# EasyEDA Pro project Scheme.eprj

# Schematic Schematic1

## Sheets
1 board: Board Name: Board1; Create Date: 2026-04-28; Page Name: board; Project Name: Scheme; Schematic Name: Schematic1; Update Date: 2026-04-28; Company: EasyEDA.com; Page Size: A4; Version: V1.0
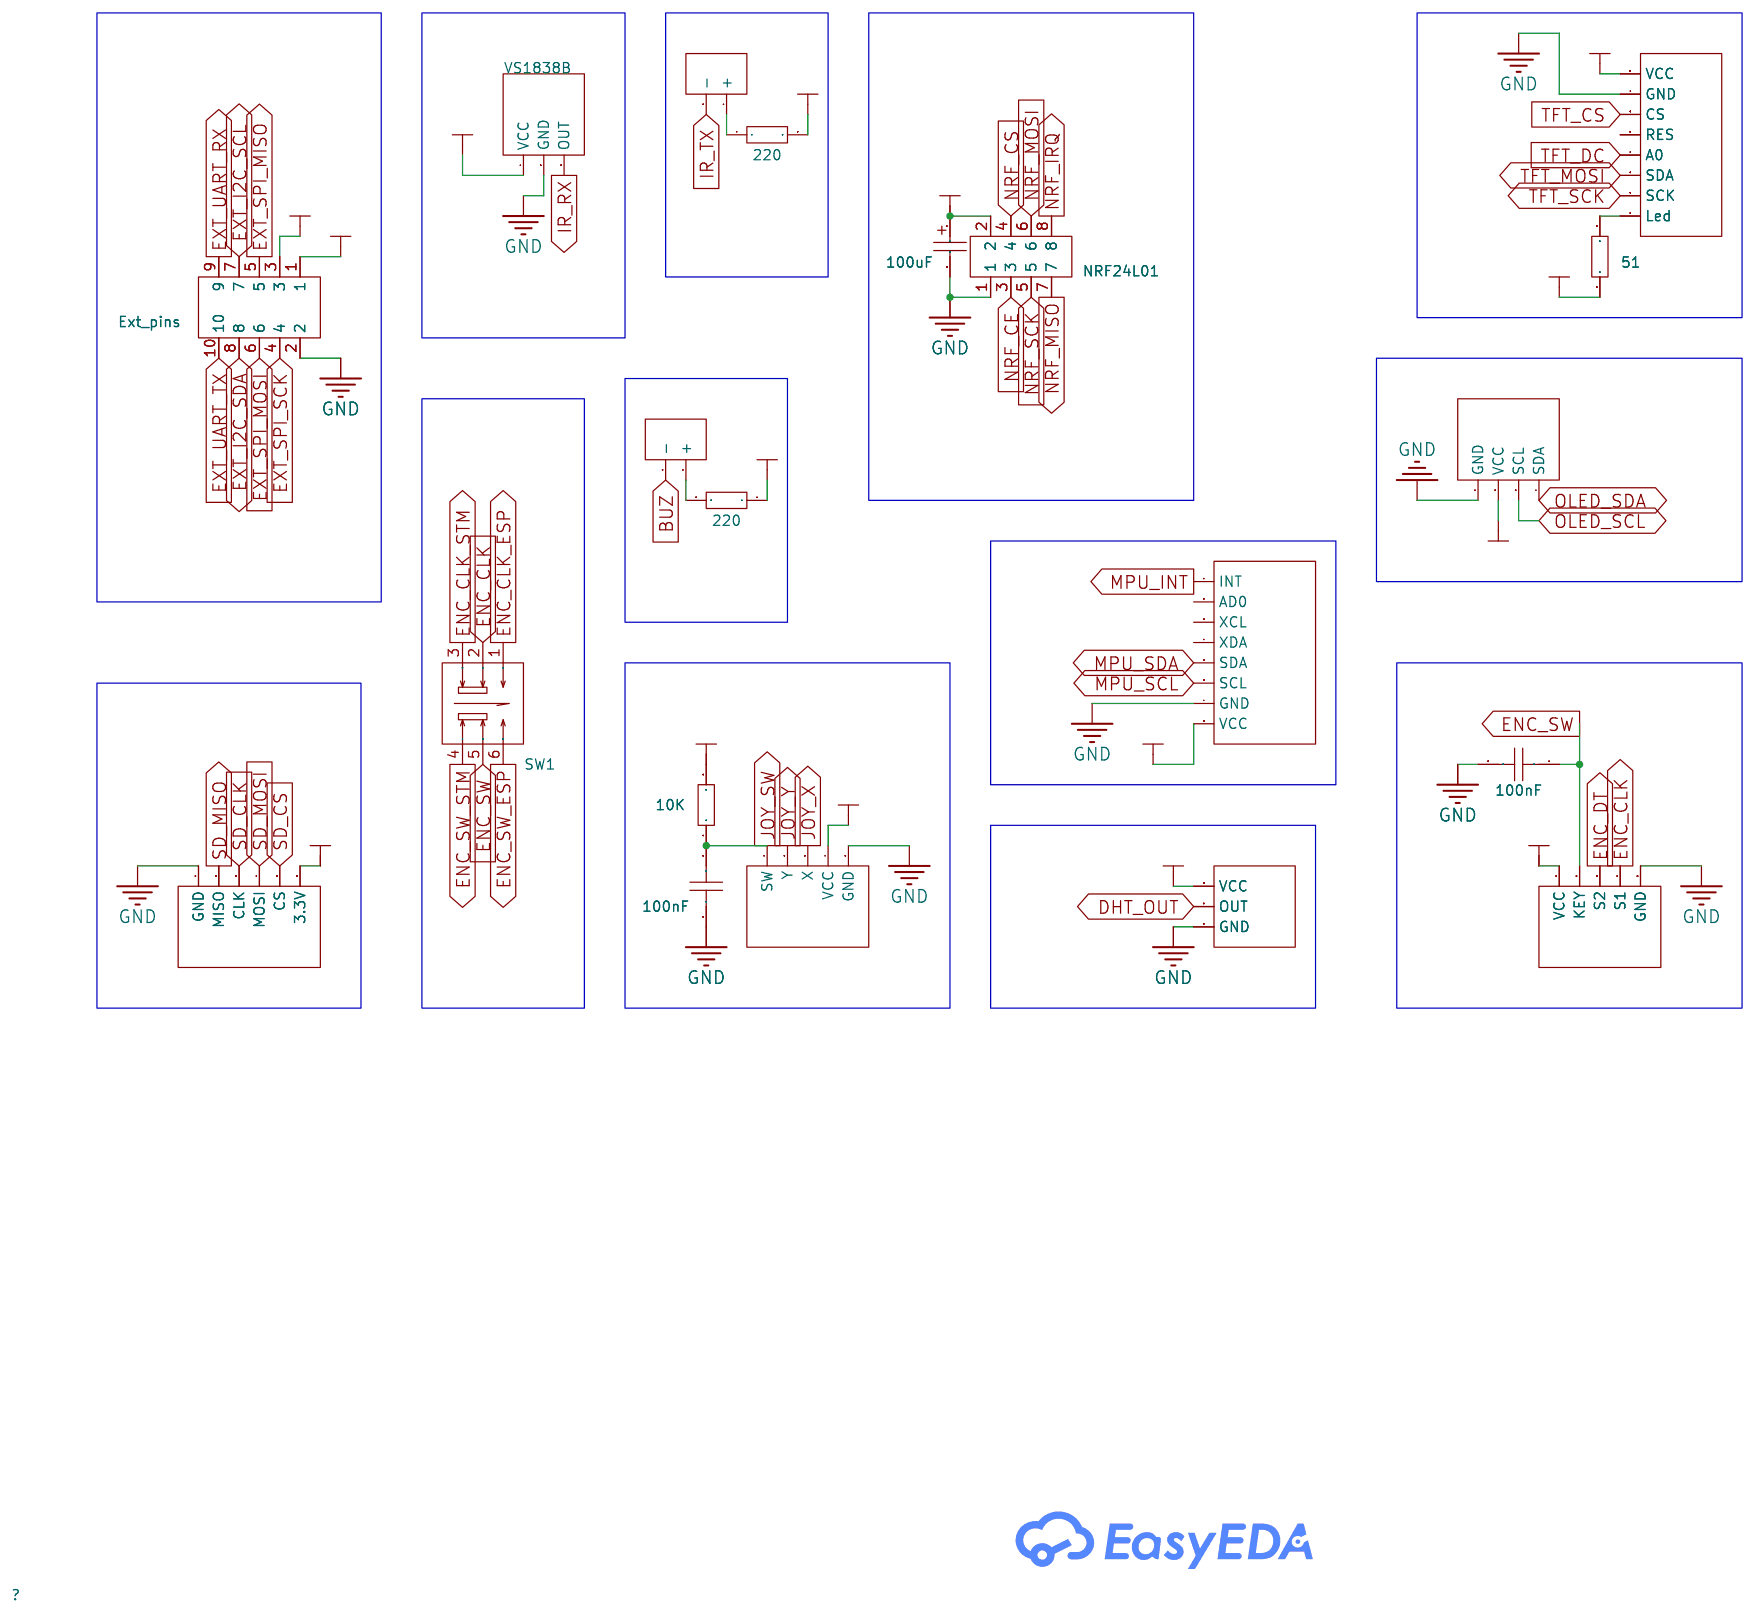
[diagram p0: board]
2 stm: Page Name: stm; Project Name: F411-board
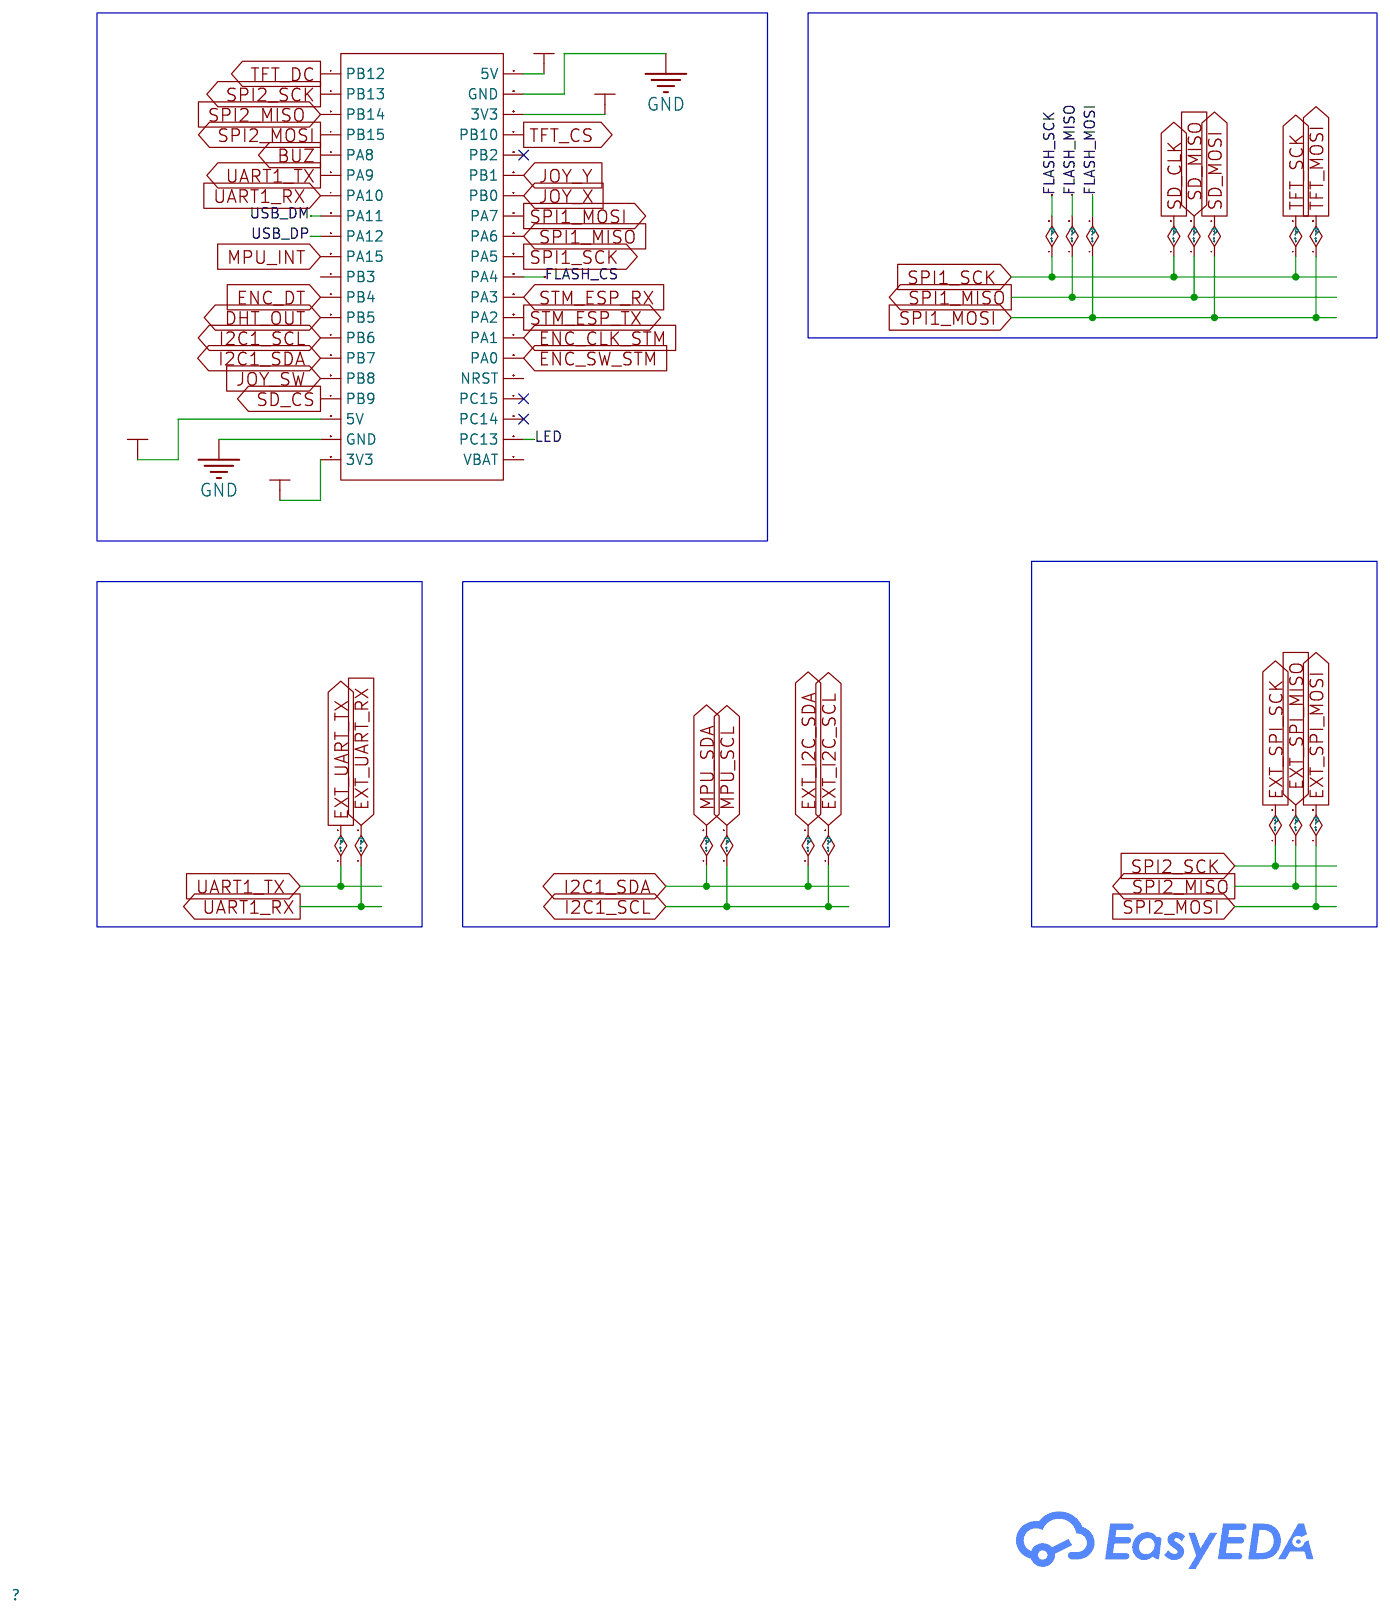
[diagram p1: stm]
3 esp: Page Name: esp; Project Name: F411-board
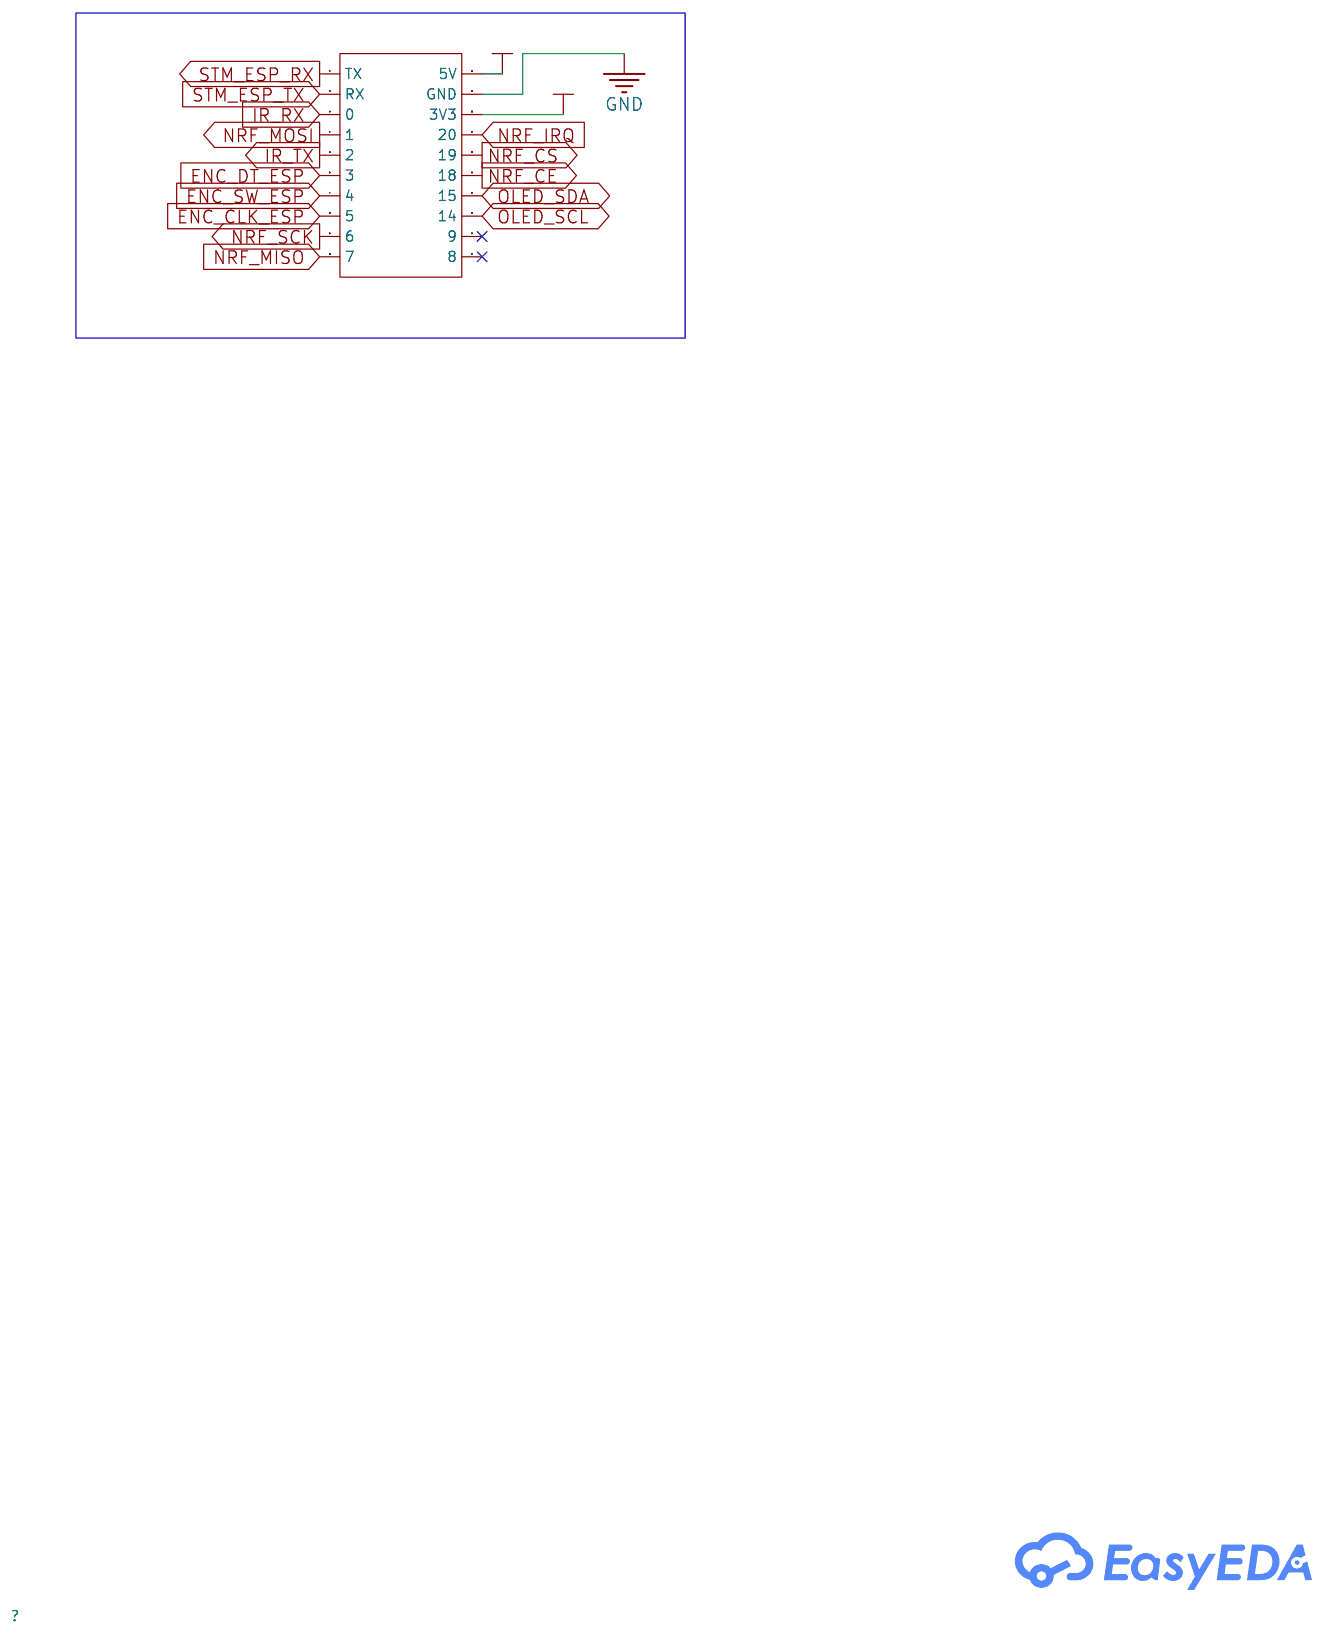
[diagram p2: esp]

## Parts
sheet board
C1  100uF  [CAP-SMD_BD3.0-L3.3-W3.3-RD]
C2  100nF  [C0805]
C3  100nF  [C0805]
H1  Ext_pins  [HDR-TH_10P-P2.54-H-M-R2-C5-S2.54-W12.9]
R1  51  [R0805]
R2  220  [R0805]
R3  220  [R0805]
R4  10K  [R0805]
SW1  XY-TBC8585-Z-F  [SW-TH_6P-L8.5-W8.5-P2.50-LS5.4-BL-2]
U5  NRF24L01  [HDR-TH_8P-P2.54-V-F-R2-C4-S2.54]
U6  -
U7  -
U8  -
U9  -
U10  -
U11  -
U12  -
U13  -
U14  VS1838B
U15  -
sheet esp
U19  -
sheet stm
U18  -

## Library data of the parts
C1 = C_Ele_SMD_3x5.4mm: Supplier Footprint: SMD,3x5.4mm
C2 C3 = CAP_0805: Supplier Footprint: 0805
H1 = PH2.54-07-05PWS: LCSC Part Name: 2x5P 间距:2.54mm 方针 弯插; Supplier Part: C7501619; Manufacturer: XUNPU(讯普); Supplier Footprint: 弯插,P=2.54mm; JLCPCB Part Class: Extended Part; Datasheet: https://item.szlcsc.com/datasheet/PH2.54-07-05PWS/8584173.html; Supplier: LCSC; Pin Structure: 2x5P; Pitch: 2.54mm; Row Spacing: 2.54mm; Circluar Pins/Square Pins: Pin Header; Mounting Type: Right Angle; Number of Rows: 2; Number of Pins: 10P; Current Rating: 3A; Length of Mating Pin: 6mm; Insulation Height: 2.5mm; Length of End Connection Pin: 3mm; Contact Material: Brass; Contact Plating: Gold; Operating Temperature: -40℃~+105℃; Color: Black
R1-R4 = Res_0805: Supplier Footprint: 0805
SW1 = XY-TBC8585-Z-F: LCSC Part Name: 按键开关 8.5*8.5自锁插件 260gf; Supplier Part: C53055056; Manufacturer: XYECONN(辛译); Supplier Footprint: DIP-6P,8.5x8.5mm; JLCPCB Part Class: Extended Part; Datasheet: https://item.szlcsc.com/datasheet/XY-TBC8585-Z-F/55998989.html; Supplier: LCSC; Circuit: DPDT; Self Lock / No Lock: Latching; Actuator Style: Rectangular Plunger; Mounting Type: Through Hole; Contact Current: 100mA; Voltage Rating: 30V; Actuator/Cap Color: White; With Lamp: Without; Termination Style: PC Pin; Operating Force: 2.6N; Life: 10,000 cycles
U5 = PM2.54-2*4-H5.7: LCSC Part Name: 2x4P 间距:2.54mm 直插; Supplier Part: C49261199; Manufacturer: ZHOURI(洲日); Supplier Footprint: 插件,P=2.54mm; JLCPCB Part Class: Extended Part; Datasheet: https://item.szlcsc.com/datasheet/PM2.54-2*4-H5.7/51704067.html; Supplier: LCSC; Holes Structure: 2x4P; Pitch: 2.54mm; Row Spacing: 2.54mm; Circular Hole / Square Hole: Square Hole; Mounting Type: Through Hole; Number of Rows: 2; Number of Positions: 8P; Current Rating: 2.5A; Holes Direction: Top; Insulation Height: 5.7mm; Contact Material: Brass; Operating Temperature: -40℃~+105℃
U6 = TFT-1.8
U7 = OLED-0.96
U8 = MicroSD
U9 = Joystick
U10 = MPU-6050
U11 = Encoder
U12 = DHT-22
U13 = Buzzer
U14 = IR-Receiver
U15 = IR-Led
U19 = ESP32-C6-SuperMini
U18 = STM32F411CEU6

## Nets
3V3: C1.1 H1.1 R3.2 R4.2 U5.2 U7.2(VCC) U8.6(3.3V) U9.4(VCC) U11.1(VCC) U12.3(VCC) U14.1(VCC) U18.20(3V3) U18.38(3V3) U19.18(3V3)
5V: H1.3 R1.1 R2.1 U6.8(VCC) U10.8(VCC) U18.18(5V) U18.40(5V) U19.20(5V)
GND: C1.2 C2.2 C3.2 H1.2 U5.1 U6.7(GND) U7.1(GND) U8.1(GND) U9.5(GND) U10.7(GND) U11.5(GND) U12.1(GND) U14.2(GND) U18.19(GND) U18.39(GND) U19.19(GND)
BUZ: U13.2(-) U18.5(PA8)
DHT_OUT: U12.2(OUT) U18.13(PB5)
ENC_CLK: SW1.2 U11.4(S1)
ENC_CLK_ESP: SW1.1 U19.8(5)
ENC_CLK_STM: SW1.3 U18.27(PA1)
ENC_DT: U11.3(S2) U18.12(PB4)
ENC_DT_ESP: U19.6(3)
ENC_SW: C2.1 SW1.5 U11.2(KEY)
ENC_SW_ESP: SW1.6 U19.7(4)
ENC_SW_STM: SW1.4 U18.26(PA0)
EXT_I2C_SCL: H1.7 U10.6(SCL) U18.14(PB6)
EXT_I2C_SDA: H1.8 U10.5(SDA) U18.15(PB7)
EXT_SPI_MISO: H1.5 U18.3(PB14)
EXT_SPI_MOSI: H1.6 U18.4(PB15)
EXT_SPI_SCK: H1.4 U18.2(PB13)
EXT_UART_RX: H1.9 U18.7(PA10)
EXT_UART_TX: H1.10 U18.6(PA9)
FLASH_CS: U18.30(PA4)
FLASH_MISO: U8.2(MISO) U18.32(PA6)
FLASH_MOSI: U6.3(SDA) U8.4(MOSI) U18.33(PA7)
FLASH_SCK: U6.2(SCK) U8.3(CLK) U18.31(PA5)
IR_RX: U14.3(OUT) U19.3(0)
IR_TX: U15.2(-) U19.5(2)
JOY_SW: C3.1 R4.1 U9.1(SW) U18.16(PB8)
JOY_X: U9.3(X) U18.34(PB0)
JOY_Y: U9.2(Y) U18.35(PB1)
LED: U18.22(PC13)
MPU_INT: U10.1(INT) U18.10(PA15)
NRF_CE: U5.3 U19.15(18)
NRF_CS: U5.4 U19.16(19)
NRF_IRQ: U5.8 U19.17(20)
NRF_MISO: U5.7 U19.10(7)
NRF_MOSI: U5.6 U19.4(1)
NRF_SCK: U5.5 U19.9(6)
OLED_SCL: U7.3(SCL) U19.13(14)
OLED_SDA: U7.4(SDA) U19.14(15)
SD_CS: U8.5(CS) U18.17(PB9)
STM_ESP_RX: U18.29(PA3) U19.1(TX)
STM_ESP_TX: U18.28(PA2) U19.2(RX)
TFT_CS: U6.6(CS) U18.37(PB10)
TFT_DC: U6.4(A0) U18.1(PB12)
USB_DM: U18.8(PA11)
USB_DP: U18.9(PA12)
Net-(R1-2): R1.2 U6.1(Led)
Net-(R2-2): R2.2 U13.1(+)
Net-(R3-1): R3.1 U15.1(+)

Not connected (* = marked no-connect by the designer): U6 5(RES); U10 2(AD0) 3(XCL) 4(XDA); U18 11(PB3) 21(VBAT) 23(PC14)* 24(PC15)* 25(NRST) 36(PB2)*; U19 11(8)* 12(9)*
